# EAGLE design vcf.lp.4p.24db-rev2 (EAGLE 9.6.2)
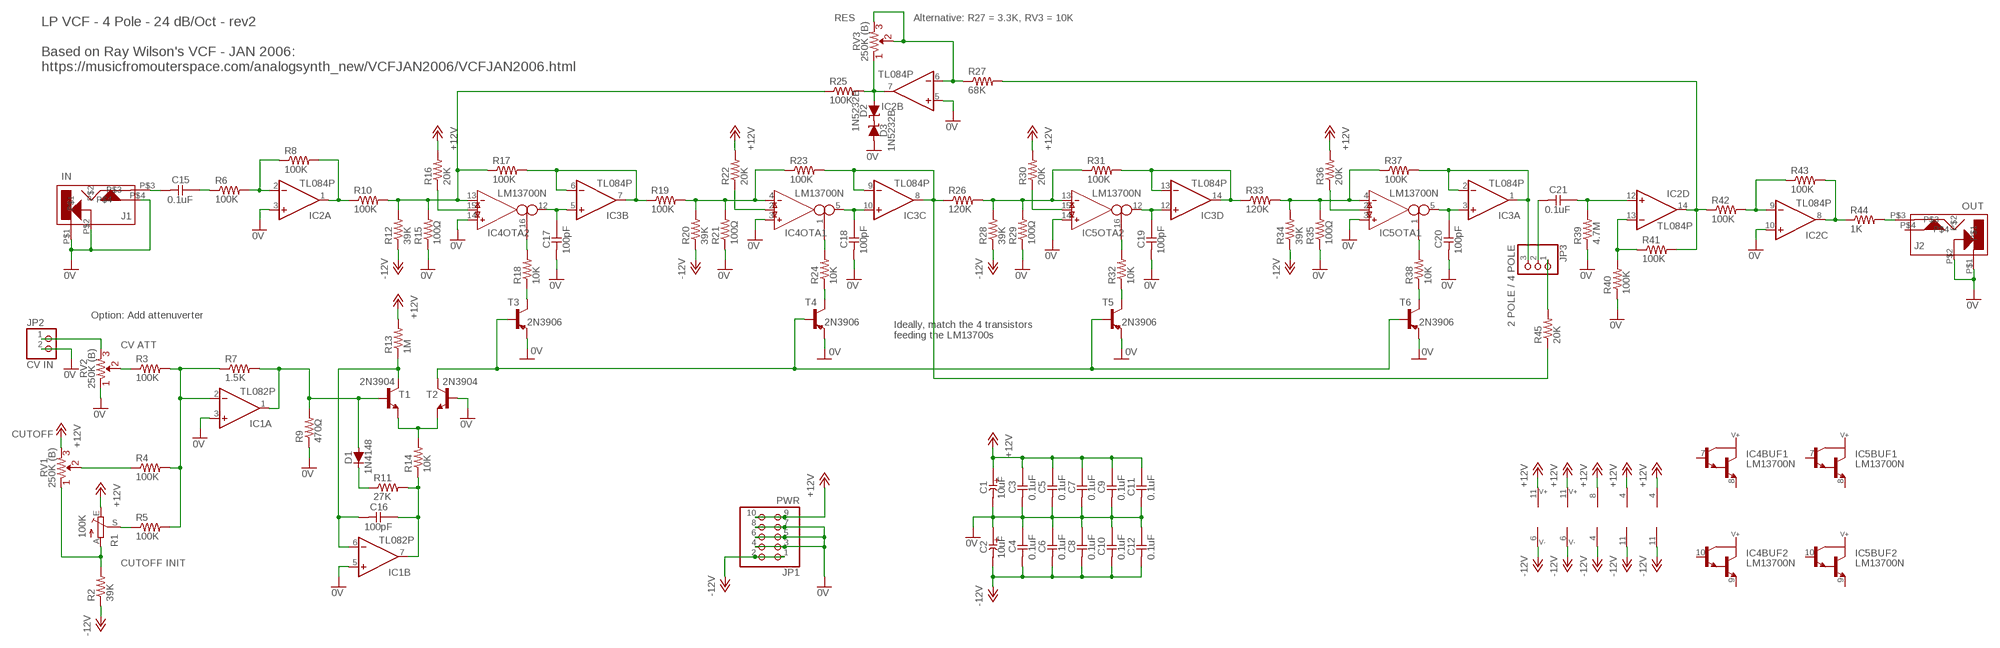
[diagram p0: schematic, sheet 1]

## Parts
C1  10uF  CE-USE2-5  [E2-5]
C2  10uF  CE-USE2-5  [E2-5]
C3  0.1uF  CC-US025-024X044  [C025-024X044]
C4  0.1uF  CC-US025-024X044  [C025-024X044]
C5  0.1uF  CC-US025-024X044  [C025-024X044]
C6  0.1uF  CC-US025-024X044  [C025-024X044]
C7  0.1uF  CC-US025-024X044  [C025-024X044]
C8  0.1uF  CC-US025-024X044  [C025-024X044]
C9  0.1uF  CC-US025-024X044  [C025-024X044]
C10  0.1uF  CC-US025-024X044  [C025-024X044]
C11  0.1uF  CC-US025-024X044  [C025-024X044]
C12  0.1uF  CC-US025-024X044  [C025-024X044]
C15  0.1uF  CC-US025-024X044  [C025-024X044]
C16  100pF  CC-US025-024X044  [C025-024X044]
C17  100pF  CC-US025-024X044  [C025-024X044]
C18  100pF  CC-US025-024X044  [C025-024X044]
C19  100pF  CC-US025-024X044  [C025-024X044]
C20  100pF  CC-US025-024X044  [C025-024X044]
C21  0.1uF  CC-US025-024X044  [C025-024X044]
D1  1N4148  [DO35-7]
D2  1N5232B  [DO34-5]
D3  1N5232B  [DO34-5]
IC1  TL082P  [DIL08]
IC2  TL084P  [DIL14]
IC3  TL084P  [DIL14]
IC4  LM13700N  [DIL16]
IC5  LM13700N  [DIL16]
J1  IN  CL1384  [CL1384]
J2  OUT  CL1384  [CL1384]
JP1  PWR  PINHD-2X5  [2X05]
JP2  CV IN  PINHD-1X2  [1X02]
JP3  2 POLE / 4 POLE  PINHD-1X3  [1X03]
R1  100K  TRIM_EU-CA6V  [CA6V]
R2  39K  R-US_0207/7  [0207/7]
R3  100K  R-US_0207/7  [0207/7]
R4  100K  R-US_0207/7  [0207/7]
R5  100K  R-US_0207/7  [0207/7]
R6  100K  R-US_0207/7  [0207/7]
R7  1.5K  R-US_0207/7  [0207/7]
R8  100K  R-US_0207/7  [0207/7]
R9  470Ω  R-US_0207/7  [0207/7]
R10  100K  R-US_0207/7  [0207/7]
R11  27K  R-US_0207/7  [0207/7]
R12  39K  R-US_0207/7  [0207/7]
R13  1M  R-US_0207/7  [0207/7]
R14  10K  R-US_0207/7  [0207/7]
R15  100Ω  R-US_0207/7  [0207/7]
R16  20K  R-US_0207/7  [0207/7]
R17  100K  R-US_0207/7  [0207/7]
R18  10K  R-US_0207/7  [0207/7]
R19  100K  R-US_0207/7  [0207/7]
R20  39K  R-US_0207/7  [0207/7]
R21  100Ω  R-US_0207/7  [0207/7]
R22  20K  R-US_0207/7  [0207/7]
R23  100K  R-US_0207/7  [0207/7]
R24  10K  R-US_0207/7  [0207/7]
R25  100K  R-US_0207/7  [0207/7]
R26  120K  R-US_0207/7  [0207/7]
R27  68K  R-US_0207/7  [0207/7]
R28  39K  R-US_0207/7  [0207/7]
R29  100Ω  R-US_0207/7  [0207/7]
R30  20K  R-US_0207/7  [0207/7]
R31  100K  R-US_0207/7  [0207/7]
R32  10K  R-US_0207/7  [0207/7]
R33  120K  R-US_0207/7  [0207/7]
R34  39K  R-US_0207/7  [0207/7]
R35  100Ω  R-US_0207/7  [0207/7]
R36  20K  R-US_0207/7  [0207/7]
R37  100K  R-US_0207/7  [0207/7]
R38  10K  R-US_0207/7  [0207/7]
R39  4.7M  R-US_0207/7  [0207/7]
R40  100K  R-US_0207/7  [0207/7]
R41  100K  R-US_0207/7  [0207/7]
R42  100K  R-US_0207/7  [0207/7]
R43  100K  R-US_0207/7  [0207/7]
R44  1K  R-US_0207/7  [0207/7]
R45  20K  R-US_0207/7  [0207/7]
RV1  250K (B)  R-VARR-VAR-10  [_COMMON_3RP/1610N]
RV2  250K (B)  R-VARR-VAR-10  [_COMMON_3RP/1610N]
RV3  250K (B)  R-VARR-VAR-10  [_COMMON_3RP/1610N]
T1  2N3904  2N3904-NPN-TO92-EBC  [TO92-EBC]
T2  2N3904  2N3904-NPN-TO92-EBC  [TO92-EBC]
T3  2N3906  2N3906-PNP-TO92-EBC  [TO92-EBC]
T4  2N3906  2N3906-PNP-TO92-EBC  [TO92-EBC]
T5  2N3906  2N3906-PNP-TO92-EBC  [TO92-EBC]
T6  2N3906  2N3906-PNP-TO92-EBC  [TO92-EBC]

## Nets
0V [power]: C1.- C2.+ C3.2 C4.1 C5.2 C6.1 C7.2 C8.1 C9.2 C10.1 C11.2 C12.1 C17.2 C18.2 C19.2 C20.2 D3.A IC1.3(A:+IN) IC1.5(B:+IN) IC2.3(A:+IN) IC2.5(B:+IN) IC2.10(C:+IN) IC4.3(OTA1:IN_P) IC4.14(OTA2:IN_P) IC5.3(OTA1:IN_P) IC5.14(OTA2:IN_P) J1.P$1 J1.P$2 J1.P$4 J2.P$1 J2.P$2 JP1.3 JP1.4 JP1.5 JP1.6 JP1.7 JP1.8 JP2.2 R9.1 R15.1 R21.1 R29.1 R35.1 R39.1 R40.1 RV2.1 T2.B T3.E T4.E T5.E T6.E
+12V [power]: C1.+ C3.1 C5.1 C7.1 C9.1 C11.1 IC1.8(P:V+) IC2.4(P:V+) IC3.4(P:V+) IC4.11(SUPPLY:V+) IC5.11(SUPPLY:V+) JP1.9 JP1.10 R1.E R13.2 R16.2 R22.2 R30.2 R36.2 RV1.3
-12V [power]: C2.- C4.2 C6.2 C8.2 C10.2 C12.2 IC1.4(P:V-) IC2.11(P:V-) IC3.11(P:V-) IC4.6(SUPPLY:V-) IC5.6(SUPPLY:V-) JP1.1 JP1.2 R2.1 R12.1 R20.1 R28.1 R34.1
N$1: R1.A R2.2 RV1.1
N$2: R4.1 RV1.2
N$3: JP2.1 RV2.3
N$4: R1.S R5.1
N$5: IC1.2(A:-IN) R3.2 R4.2 R5.2 R7.1
N$6: D1.A IC1.1(A:OUT) R7.2 R9.2 T1.B
N$7: IC3.6(B:-IN) IC3.7(B:OUT) R17.2 R19.1
N$8: R14.2 T1.E T2.E
N$9: C15.2 J1.P$3
N$10: D1.C R11.1
N$11: C16.1 IC1.7(B:OUT) R11.2 R14.1
N$12: C16.2 IC1.6(B:-IN) R13.1 T1.C
N$13: R3.1 RV2.2
N$14: T2.C T3.B T4.B T5.B T6.B
N$15: IC4.1(OTA1:I_BIAS) R24.2
N$16: R18.1 T3.C
N$17: C17.1 IC3.5(B:+IN) IC4.12(OTA2:OUT)
N$18: IC4.16(OTA2:I_BIAS) R18.2
N$19: IC4.15(OTA2:I_DIODE) R16.1
N$20: IC4.4(OTA1:IN_N) R19.2 R20.2 R21.2 R23.1
N$21: IC4.2(OTA1:I_DIODE) R22.1
N$22: IC4.13(OTA2:IN_N) R10.2 R12.2 R15.2 R17.1 R25.1
N$23: R24.1 T4.C
N$24: C18.1 IC3.10(C:+IN) IC4.5(OTA1:OUT)
N$25: IC3.8(C:OUT) IC3.9(C:-IN) R23.2 R26.1 R45.1
N$26: IC5.13(OTA2:IN_N) R26.2 R28.2 R29.2 R31.1
N$27: IC5.4(OTA1:IN_N) R33.2 R34.2 R35.2 R37.1
N$28: IC5.15(OTA2:I_DIODE) R30.1
N$29: IC3.13(D:-IN) IC3.14(D:OUT) R31.2 R33.1
N$30: C19.1 IC3.12(D:+IN) IC5.12(OTA2:OUT)
N$31: IC5.16(OTA2:I_BIAS) R32.2
N$32: R32.1 T5.C
N$33: IC5.1(OTA1:I_BIAS) R38.2
N$34: IC5.2(OTA1:I_DIODE) R36.1
N$35: D2.C D3.C
N$36: C21.2 JP3.2
N$37: JP3.1 R45.2
N$38: R38.1 T6.C
N$39: C21.1 IC2.12(D:+IN) R39.2
N$41: C20.1 IC3.3(A:+IN) IC5.5(OTA1:OUT)
N$42: IC2.13(D:-IN) R40.2 R41.1
N$43: IC2.14(D:OUT) R27.2 R41.2 R42.1
N$44: J2.P$3 R44.2
N$45: IC2.1(A:OUT) R8.2 R10.1
N$46: IC2.2(A:-IN) R6.2 R8.1
N$47: D2.A IC2.7(B:OUT) R25.2 RV3.1
N$48: C15.1 R6.1
N$50: IC2.6(B:-IN) R27.1 RV3.2 RV3.3
N$64: IC2.9(C:-IN) R42.2 R43.1
N$65: IC3.1(A:OUT) IC3.2(A:-IN) JP3.3 R37.2
N$66: IC2.8(C:OUT) R43.2 R44.1
Unconnected: IC4.7(BUF1:B) IC4.8(BUF1:E) IC4.9(BUF2:E) IC4.10(BUF2:B) IC5.7(BUF1:B) IC5.8(BUF1:E) IC5.9(BUF2:E) IC5.10(BUF2:B) J2.P$4

## Notes on the sheet
- RES | Alternative: R27 = 3.3K, RV3 = 10K
- LP VCF - 4 Pole - 24 dB/Oct - rev2
  
  Based on Ray Wilson's VCF - JAN 2006:
  https://musicfromouterspace.com/analogsynth_new/VCFJAN2006/VCFJAN2006.html
- Option: Add attenuverter
- Ideally, match the 4 transistors
  feeding the LM13700s
- CV ATT
- CUTOFF
- CUTOFF INIT

## Library data of the parts
C1 C2 = _common.v1:CE-US: ELECTROLYTIC CAPACITOR, US symbol
C3-C12 C15-C21 = _common.v1:CC-US: CAPACITOR, US symbol
D1 = _common.v1:1N4148: DIODE high speed (Philips)
D2 D3 = _common:1N5232B: ZENER DIODE 500mW 5.6V DO-35; Zener Voltage Vz Typ:5.6V; Power Dissipation Pd:500mW; Diode Case Style:DO-35; No. of Pins:2; Operating Temperature Max:175 C;
IC1 = linear:TL082: OP AMP Data sheet <http://www.ti.com/lit/ds/symlink/tl084a . pdf>; DATA_SHEET: <a href="http://www.ti.com/lit/ds/symlink/tl084a.pdf"> Data sheet </a>
IC2 IC3 = linear:TL084: OP AMP
IC4 IC5 = ota:LM13700: Dual OTA with buffers
J1 J2 = jacks:CL1384
JP1 = pinhead:PINHD-2X5: PIN HEADER
JP2 = pinhead:PINHD-1X2: PIN HEADER
JP3 = pinhead:PINHD-1X3: PIN HEADER
R1 = pot:TRIM_EU-: POTENTIOMETER
R2-R45 = resistor:R-US_: RESISTOR, American symbol
RV1-RV3 = _common:R-VAR
T1 T2 = transistor-neu-to92:*-NPN-: NPN Transistror
T3-T6 = transistor-neu-to92:*-PNP-: PNP Transistror

## Net classes
0 default: width 0.406 mm, clearance 0.305 mm
1 power: width 0.813 mm, clearance 0.305 mm

## Board
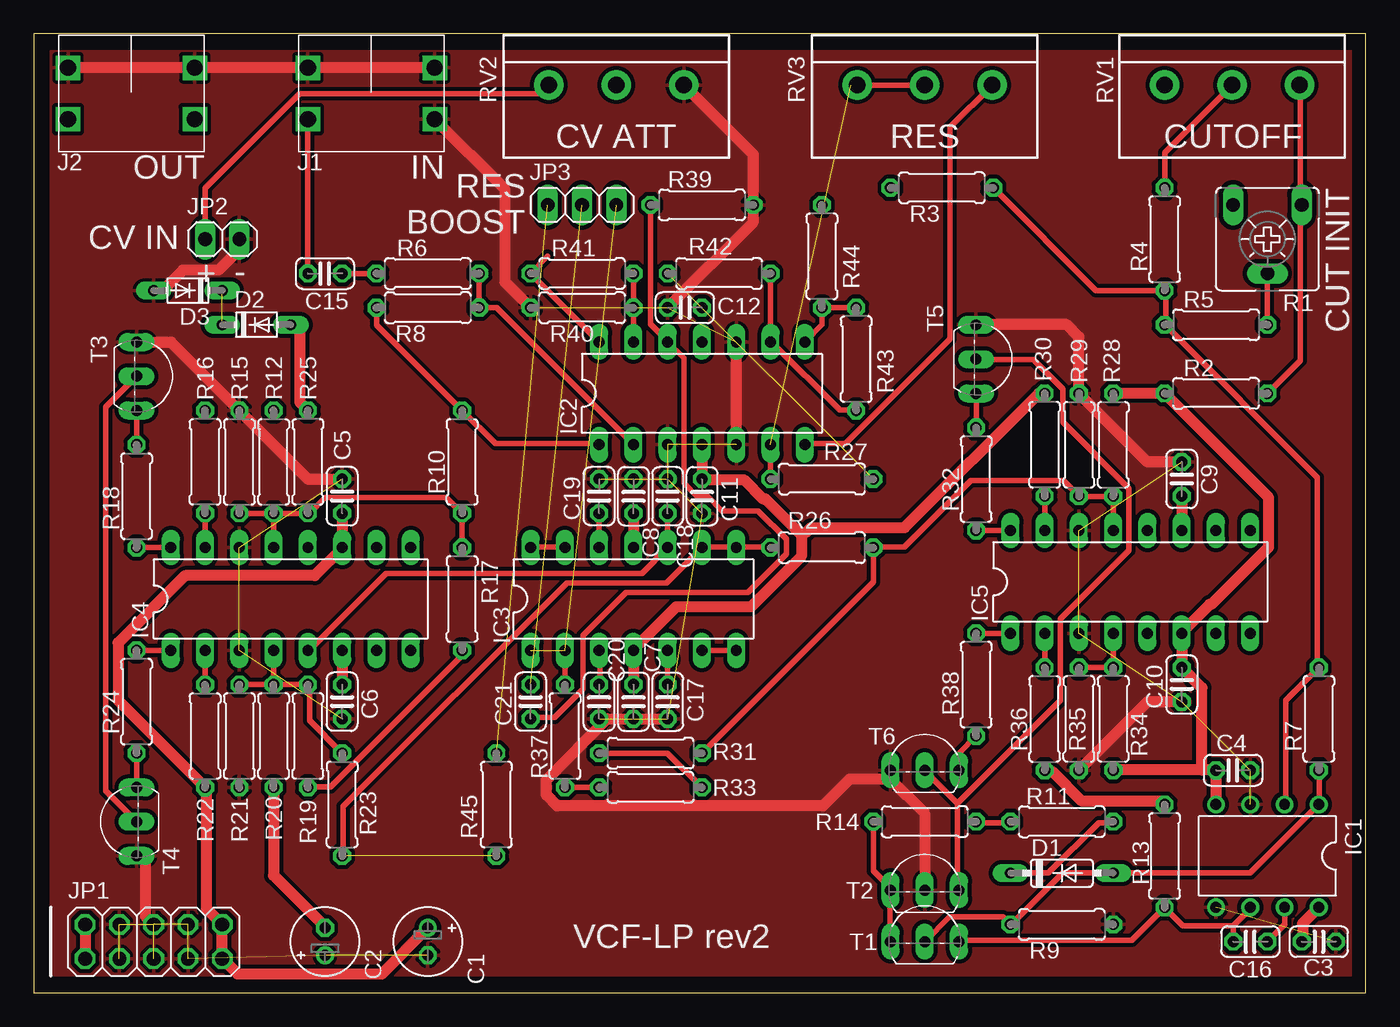
[diagram p1: board, top side]
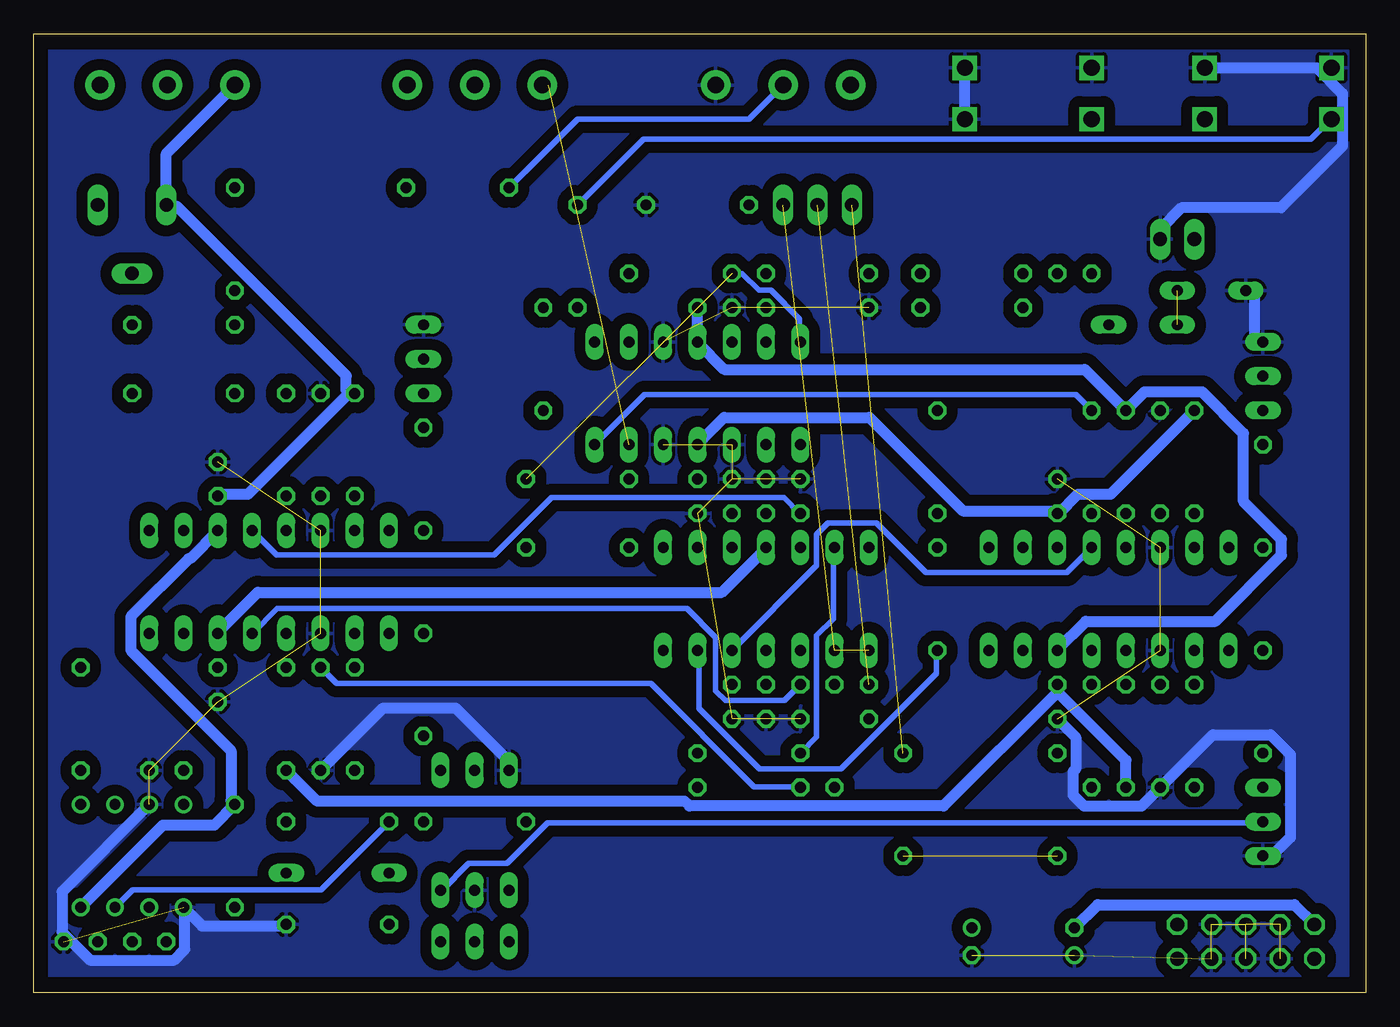
[diagram p2: board, bottom side, seen from below]

Size 98.73 x 71.11 mm. Coordinates in mm from the lower left corner, seen from the top.
Outline: 0,0 98.73,0 98.73,71.11 0,71.11 0,0
Copper layers (1*16): Top 0.035mm / dielectric 1.5mm / Bottom 0.035mm
Design rules "default": minimum track width 6mil, minimum drill 0.35mm, track to track 6mil, track to pad 6mil, pad to pad 6mil, via to via 6mil, smd to smd 6mil, copper to edge 40mil, drill to drill 6mil, minimum pad ring 10mil, minimum via ring 8mil, stop-mask expansion 4mil, vias tented up to drill 0mil, thermal gap 10mil

### Footprints (pad centres in the part's own frame; a part is rotated, then mirrored left to right if it is on the bottom)
E2-5 = drill 0.813 pad 1.27: + -1.016,0 | drill 0.813 pad 1.27 octagon: - 1.016,0
C025-024X044 = drill 0.813 octagon: 1 -1.27,0; 2 1.27,0
DO35-7 = drill 0.813 long: A 3.81,0; C -3.81,0
DO34-5 = drill 0.813 long: A 2.54,0; C -2.54,0
DIL08 = drill 0.813 pad 1.27: 1 -3.81,-3.81; 2 -1.27,-3.81; 3 1.27,-3.81; 4 3.81,-3.81; 5 3.81,3.81; 6 1.27,3.81; 7 -1.27,3.81; 8 -3.81,3.81
DIL14 = drill 0.813 long: 1 -7.62,-3.81; 2 -5.08,-3.81; 3 -2.54,-3.81; 4 0,-3.81; 5 2.54,-3.81; 6 5.08,-3.81; 7 7.62,-3.81; 8 7.62,3.81; 9 5.08,3.81; 10 2.54,3.81; 11 0,3.81; 12 -2.54,3.81; 13 -5.08,3.81; 14 -7.62,3.81
DIL16 = drill 0.813 long: 1 -8.89,-3.81; 2 -6.35,-3.81; 3 -3.81,-3.81; 4 -1.27,-3.81; 5 1.27,-3.81; 6 3.81,-3.81; 7 6.35,-3.81; 8 8.89,-3.81; 9 8.89,3.81; 10 6.35,3.81; 11 3.81,3.81; 12 1.27,3.81; 13 -1.27,3.81; 14 -3.81,3.81; 15 -6.35,3.81; 16 -8.89,3.81
CL1384 = drill 1.2 square: P$1 0,0; P$2 9.4,0; P$3 0,-3.8; P$4 9.4,-3.8
2X05 = drill 1.016 octagon: 1 -5.08,-1.27; 2 -5.08,1.27; 3 -2.54,-1.27; 4 -2.54,1.27; 5 0,-1.27; 6 0,1.27; 7 2.54,-1.27; 8 2.54,1.27; 9 5.08,-1.27; 10 5.08,1.27
1X02 = drill 1.016 long: 1 -1.27,0; 2 1.27,0
1X03 = drill 1.016 long: 1 -2.54,0; 2 0,0; 3 2.54,0
CA6V = drill 1.016 long: A -2.54,-2.54; E 2.54,-2.54; S 0,2.54
0207/7 = drill 0.813 octagon: 1 -3.81,0; 2 3.81,0
_COMMON_3RP/1610N = drill 1.2 pad 2.184: 1 -5,0; 2 0,0; 3 5,0
TO92-EBC = drill 0.813 long: B 0,-1.27; C 2.54,-1.27; E -2.54,-1.27

### Placement (x,y rotation side)
C1  29.21,3.81 270 top
C2  21.59,3.81 90 top
C3  95.25,3.81 0 top
C4  88.9,16.51 180 top
C5  22.86,36.83 90 top
C6  22.86,21.59 90 top
C7  44.45,21.59 270 top
C8  44.45,36.83 270 top
C9  85.09,38.1 90 top
C10  85.09,22.86 90 top
C11  49.53,36.83 270 top
C12  48.26,50.8 0 top
C15  21.59,53.34 180 top
C16  90.17,3.81 180 top
C17  46.99,21.59 270 top
C18  46.99,36.83 90 top
C19  41.91,36.83 90 top
C20  41.91,21.59 270 top
C21  36.83,21.59 90 top
D1  76.2,8.89 0 top
D2  16.51,49.53 0 top
D3  11.43,52.07 180 top
IC1  91.44,10.16 180 top
IC2  49.53,44.45 0 top
IC3  44.45,29.21 0 top
IC4  19.05,29.21 0 top
IC5  81.28,30.48 0 top
J1  20.32,68.58 0 top
J2  2.54,68.58 0 top
JP1  8.89,3.81 0 top
JP2  13.97,55.88 0 top
JP3  40.64,58.42 0 top
R1  91.44,55.88 180 top
R2  87.63,44.45 0 top
R3  67.31,59.69 0 top
R4  83.82,55.88 270 top
R5  87.63,49.53 180 top
R6  29.21,53.34 0 top
R7  95.25,20.32 270 top
R8  29.21,50.8 180 top
R9  76.2,5.08 180 top
R10  31.75,39.37 270 top
R11  76.2,12.7 180 top
R12  17.78,39.37 270 top
R13  83.82,10.16 90 top
R14  66.04,12.7 180 top
R15  15.24,39.37 270 top
R16  12.7,39.37 90 top
R17  31.75,29.21 270 top
R18  7.62,36.83 270 top
R19  20.32,19.05 90 top
R20  17.78,19.05 90 top
R21  15.24,19.05 90 top
R22  12.7,19.05 270 top
R23  22.86,13.97 270 top
R24  7.62,21.59 90 top
R25  20.32,39.37 90 top
R26  58.42,33.02 0 top
R27  58.42,38.1 0 top
R28  80.01,40.64 270 top
R29  77.47,40.64 270 top
R30  74.93,40.64 90 top
R31  45.72,17.78 180 top
R32  69.85,38.1 270 top
R33  45.72,15.24 180 top
R34  80.01,20.32 90 top
R35  77.47,20.32 90 top
R36  74.93,20.32 270 top
R37  39.37,19.05 90 top
R38  69.85,22.86 90 top
R39  49.53,58.42 180 top
R40  40.64,50.8 0 top
R41  40.64,53.34 180 top
R42  50.8,53.34 0 top
R43  60.96,46.99 90 top
R44  58.42,54.61 90 top
R45  34.29,13.97 90 top
RV1  88.82,67.31 180 top
RV2  43.18,67.31 180 top
RV3  66.04,67.31 180 top
T1  66.04,5.08 0 top
T2  66.04,8.89 0 top
T3  8.89,45.72 270 top
T4  6.35,12.7 90 top
T5  71.12,46.99 270 top
T6  66.04,17.78 0 top

### Tracks (layer width: path | path; a pad name or v marks a point on that pad's centre or on a via)
0V  (26 unrouted)
  Top 0.813: J2.P$1 J2.P$2 J1.P$1 J1.P$2 | R40.1 34.92,52.7 34.92,59.58 J1.P$4 | RV2.1 53.34,62.15 R39.1 53.34,57.15 C12.1 | IC2.5 52.07,41.3 52.07,47.6 IC2.10 | JP2.2 15.24,55.12 13.72,53.59 11.07,53.59 9.55,52.07 D3.A | T3.E 8.28,48.26 10.16,48.26 R15.1 20.32,38.1 C5.2 | T4.E 8.28,10.16 8.28,5.69 JP1.6 | 63.5,15.85 T6.E 63.5,15.85 | 63.5,15.85 60.47,15.85 58.48,13.87 38.8,13.87 38,14.67 38,15.81 42.51,20.32 C17.2 | C10.1 82.55,21.59 R35.1 | 63.5,15.85 66.04,13.31 66.04,8.28 T2.B | C9.2 82.55,39.37 R29.1 77.47,48.63 76.57,49.53 70.51,49.53 T5.E
  Bottom 0.813: J1.P$4 J1.P$2 | D3.A 8.23,52.07 8.28,52.02 8.28,48.26 T3.E | T4.E 6.96,10.16 5.59,11.53 5.59,17.69 7.05,19.15 11.33,19.15 R21.1 16.61,13.87 20.89,13.87 21.69,14.67 21.69,16.41 21.49,16.61 21.49,18.95 C6.1 | R35.1 72.85,21.13 67.46,21.13 63.5,17.17 T6.E | IC1.3 96.62,7.52 96.62,4.51 94.55,2.44 88.33,2.44 87.53,3.24 87.53,6.25 IC1.5 86.26,4.98 80.11,4.98 R9.1 | J2.P$2 3.63,68.58 1.73,66.68 1.73,62.79 6.3,58.22 13.66,58.22 15.24,56.64 JP2.2
  pour Top: 1.27,69.85 97.79,69.85 97.79,1.27 1.27,1.27
  pour Bottom (isolate 0.813): 1.27,69.85 97.79,69.85 97.79,1.27 1.27,1.27
+12V
  Top 0.813: IC1.8 94.06,5.16 94.06,3.89 C3.1 | R13.2 83.57,14.22 77.7,14.22 75.56,16.36 75.03,16.36 R36.2 | C7.1 IC3.4 44.45,25.46 47.62,28.63 53.16,28.63 56.9,32.36 56.9,33.96 | 56.9,33.96 54.23,36.63 54.05,36.63 52.63,38.05 49.58,38.05 C11.1 IC2.4 | R30.2 74.5,44.45 64.54,34.49 57.61,34.49 57.25,34.14 56.9,33.96 | C9.1 IC5.11 | C5.1 IC4.11 22.86,32.96 20.84,30.94 11.22,30.94 6.25,25.97 6.25,21.69 R22.2 12.8,15.14 12.8,6.25 JP1.10 JP1.9 13.99,2.54 15.11,1.42 25.81,1.42 C1.+
  Bottom 0.813: 75.39,44.45 R30.2 | 75.39,44.45 82.86,36.98 84.94,36.98 C9.1 | R16.2 18.9,36.98 21.34,36.98 22.76,35.56 C5.1 23.04,35.74 29.87,35.74 36.8,42.67 47.56,42.67 49.53,40.7 IC2.4 | 75.39,44.45 75.56,44.63 75.56,45.76 88.13,58.32 88.8,58.32 R1.E 88.9,62.23 RV1.3 | IC5.11 85.09,34.23 87.14,32.18 87.26,32.18 91.54,27.9 91.54,25.4 84.1,17.96 84.1,14.25 R13.2 85.34,12.45 89.15,12.45 IC1.8
-12V
  Top 0.813: R28.1 R2.1 91.54,36.73 91.54,33.06 87.28,28.8 87.16,28.8 85.09,26.73 IC5.6 C10.2 86.59,22.63 86.59,16.54 | C8.2 IC3.11 | 86.59,16.54 87.48,16.54 C4.2 IC1.4 | C2.- 21.51,4.98 17.78,8.71 R20.1 | IC4.6 C6.2 | JP1.2 JP1.1 | 86.59,16.54 80.03,16.54 R34.1
  Bottom 0.813: 22.76,22.23 22.76,22.76 C6.2 | 22.76,22.23 17.78,17.25 R20.1 | 22.76,22.23 22.94,22.23 31.29,13.87 50.14,13.87 50.49,14.22 77.72,14.22 R34.1 | C12.2 IC2.11 49.53,48.2 47.56,46.23 20.83,46.23 R12.1 16.41,44.55 12.13,44.55 9.07,41.49 9.07,36.45 6.25,33.63 6.25,32.45 11.14,27.56 20.76,27.56 22.86,25.46 IC4.6 | C2.- 19.86,6.55 5.28,6.55 JP1.2 | IC5.6 85.09,26.73 82.13,29.69 47.72,29.69 44.45,32.96 IC3.11
N$1
  Top 0.406: R2.2 93.88,46.89 93.88,58.32 R1.A 93.88,58.52 93.88,67.25 RV1.1
N$2
  Top 0.406: RV1.2 83.82,62.31 R4.1
N$3
  Top 0.406: RV2.3 37.55,66.68 19.7,66.68 12.7,59.68 12.7,56.64 JP2.1
N$4
  Top 0.406: R1.S R5.1
N$5
  Top 0.406: R3.2 78.74,52.07 R4.2 83.92,51.92 83.92,49.61 R5.2 95.12,38.23 95.12,24.26 R7.1 92.81,21.69 92.81,14.07 IC1.2
N$6
  Top 0.406: R7.2 95.3,16.36 95.3,14.05 IC1.1 90.17,8.89 D1.A 76.28,8.89 72.47,5.08 R9.2 71.83,5.64 67.87,5.64 T1.B
N$7
  Top 0.406: R17.2 31.65,25.3 31.65,24.92 22.02,15.29 20.37,15.29 R19.1 | IC3.7 IC3.6
  Bottom 0.406: R17.2 31.83,25.32 31.83,23.67 38.89,16.61 44.93,16.61 49.43,21.11 49.43,25.3 IC3.6
N$8
  Top 0.406: T1.E 63.48,3.91 63.48,7.47 T2.E 63.5,7.8 62.23,9.07 R14.2
N$9
  Top 0.406: J1.P$3 C15.2
N$10
  Top 0.406: D1.C 75.21,8.89 78.94,12.62 79.93,12.62 R11.1
N$11
  Top 0.406: R14.1 69.88,12.62 72.36,12.62 R11.2 | IC1.7 92.71,5.08 C16.1
  Bottom 0.406: IC1.7 92.69,6.35 91.39,7.64 77.44,7.64 R11.2
N$12
  Top 0.406: 88.9,4.98 C16.2 | 88.9,4.98 85.17,4.98 83.92,6.22 R13.1 81.38,3.91 68.68,3.91 T1.C | IC1.6 90.17,6.25 88.9,4.98
N$13
  Bottom 0.406: R3.1 58.41,64.78 45.7,64.78 RV2.2
N$14
  Top 0.406: T5.B 69.9,46.94 74.09,46.94 76.28,44.76 76.28,42.32 81.18,37.41 81.18,32.82 76.1,27.74 76.1,21.69 68.45,14.05 | 68.45,14.05 68.45,7.75 T2.C | T3.B 5.33,43.43 5.33,14.99 T4.B | T6.B 66.04,16.46 68.45,14.05
  Bottom 0.406: T2.C 68.48,7.62 66.5,9.6 63.65,9.6 60.63,12.62 7.7,12.62 T4.B
N$15
  Top 0.406: IC4.1 R24.2
N$16
  Top 0.406: T3.C R18.1
N$17
  Top 0.406: IC3.5 C17.1
  Bottom 0.406: IC3.5 40.72,31.67 40.72,33.99 39.85,34.85 36.27,34.85 32.61,31.19 22.15,31.19 IC4.12
N$18
  Top 0.406: IC4.16 R18.2
N$19
  Top 0.406: R16.1 IC4.15
N$20
  Top 0.406: R20.2 IC4.4 | R23.1 20.45,20.19 20.45,22.73 R19.2 R20.2 | R20.2 R21.2
N$21
  Top 0.406: IC4.2 R22.1
N$22
  Top 0.406: R12.2 IC4.13 | R12.2 R15.2 | R12.2 R25.1 20.45,35.56 21.61,36.73 30.58,36.73 R10.2 R17.1
N$23
  Top 0.406: T4.C 7.64,15.29 7.64,17.78 R24.1
N$24
  Top 0.406: C18.1 IC3.10 45.09,31.11 26.14,31.11 20.42,25.4 IC4.5
N$25  (1 unrouted)
  Top 0.406: R26.1 54.59,33.07 52.09,33.07 IC3.8 51.92,33.07 49.61,33.07 IC3.9 46.91,30.4 39.52,30.4 22.94,13.82 22.94,10.24 R23.2
N$26
  Top 0.406: IC5.13 R28.2 80.01,36.8 77.52,36.8 R29.2 76.3,38 69.47,38 64.54,33.07 62.28,33.07 R26.2 62.23,30.48 R31.1
N$27
  Top 0.406: IC5.4 R34.2 R35.2 | R33.2 R37.1
  Bottom 0.406: R35.2 76.28,22.94 52.98,22.94 45.34,15.29 41.96,15.29 R33.2
N$28
  Top 0.406: R30.1 IC5.15
N$29
  Top 0.406: IC3.14 36.98,33.07 39.29,33.07 IC3.13 | R31.2 46.99,17.78 R33.1
  Bottom 0.406: IC3.13 39.47,32.92 39.47,27.74 40.72,26.49 40.72,18.97 R31.2
N$30
  Top 0.406: C19.1 IC3.12
  Bottom 0.406: C19.1 41.96,35.56 43.13,36.73 60.35,36.73 64.62,32.46 80.72,32.46 IC5.12
N$31
  Top 0.406: IC5.16 R32.2
N$32
  Top 0.406: R32.1 69.88,41.96 69.88,44.45 T5.C
N$33
  Top 0.406: IC5.1 R38.2
N$34
  Top 0.406: IC5.2 R36.1
N$35  (1 unrouted)
N$36  (1 unrouted)
N$37  (1 unrouted)
N$38
  Top 0.406: T6.C 68.63,16.56 68.63,17.83 R38.1
N$39
  Top 0.406: C21.1 36.96,20.45 38.61,20.45 40.72,22.55 40.72,26.52 43.89,29.69 52.94,29.69 55.78,32.54 55.78,33.66 53.7,35.74 51.03,35.74 49.96,36.8 49.17,36.8 48.18,37.79 48.18,47.07 IC2.12 46.99,48.31 45.72,49.58 R39.2
N$41
  Top 0.406: C20.1 41.96,22.94 41.96,25.25 IC3.3
  Bottom 0.406: IC5.5 82.5,26.67 80.67,28.5 50.32,28.5 48.18,26.37 48.18,22.4 47.47,21.69 43.08,21.69 C20.1
N$42
  Top 0.406: IC2.13 R40.2 R41.1
N$43  (1 unrouted)
  Top 0.406: IC2.14 R41.2 38.1,54.61
  Bottom 0.406: R42.1 46.23,53.34 44.98,52.09 44.09,52.09 41.96,49.96 41.96,48.31 IC2.14
N$44
  Bottom 0.406: J2.P$3 2.61,64.78 4.09,63.3 53.54,63.3 R44.2
N$45
  Top 0.406: IC2.1 41.83,40.72 34.21,40.72 R10.1 25.43,49.51 25.43,50.77 R8.2
N$46
  Top 0.406: IC2.2 34.29,50.8 R8.1 R6.2
N$47
  Top 0.406: RV3.1 67.92,64.19 67.92,48.49 60.15,40.72 57.23,40.72 IC2.7
  Top 0.813: D2.A 19.71,49.53 19.71,43.79 R25.2
  Bottom 0.406: IC2.7 53.44,44.35 21.49,44.35 R25.2
N$48
  Top 0.406: R6.1 C15.1
N$50  (1 unrouted)
  Top 0.406: 60.58,67.31 RV3.3 RV3.2 | IC2.6 54.61,39.98 R27.1
N$64
  Top 0.406: R42.2 IC2.9 54.69,48.26 59.74,43.2 60.94,43.2 R43.1
N$65  (2 unrouted)
  Top 0.406: IC3.2 R37.2
N$66
  Top 0.406: R43.2 R44.1 58.42,49.53 IC2.8

### Text on the board
tNames: CV ATT | RES | CUTOFF | OUT | IN | CUT INIT | RES / BOOST | CV IN | - | + | VCF-LP rev2
tDocu: The board needs a serious rework on the layout and routing.